# Altium schematic sheet OZ440-SE100-CAR003_sheet4.SchDoc
size A3
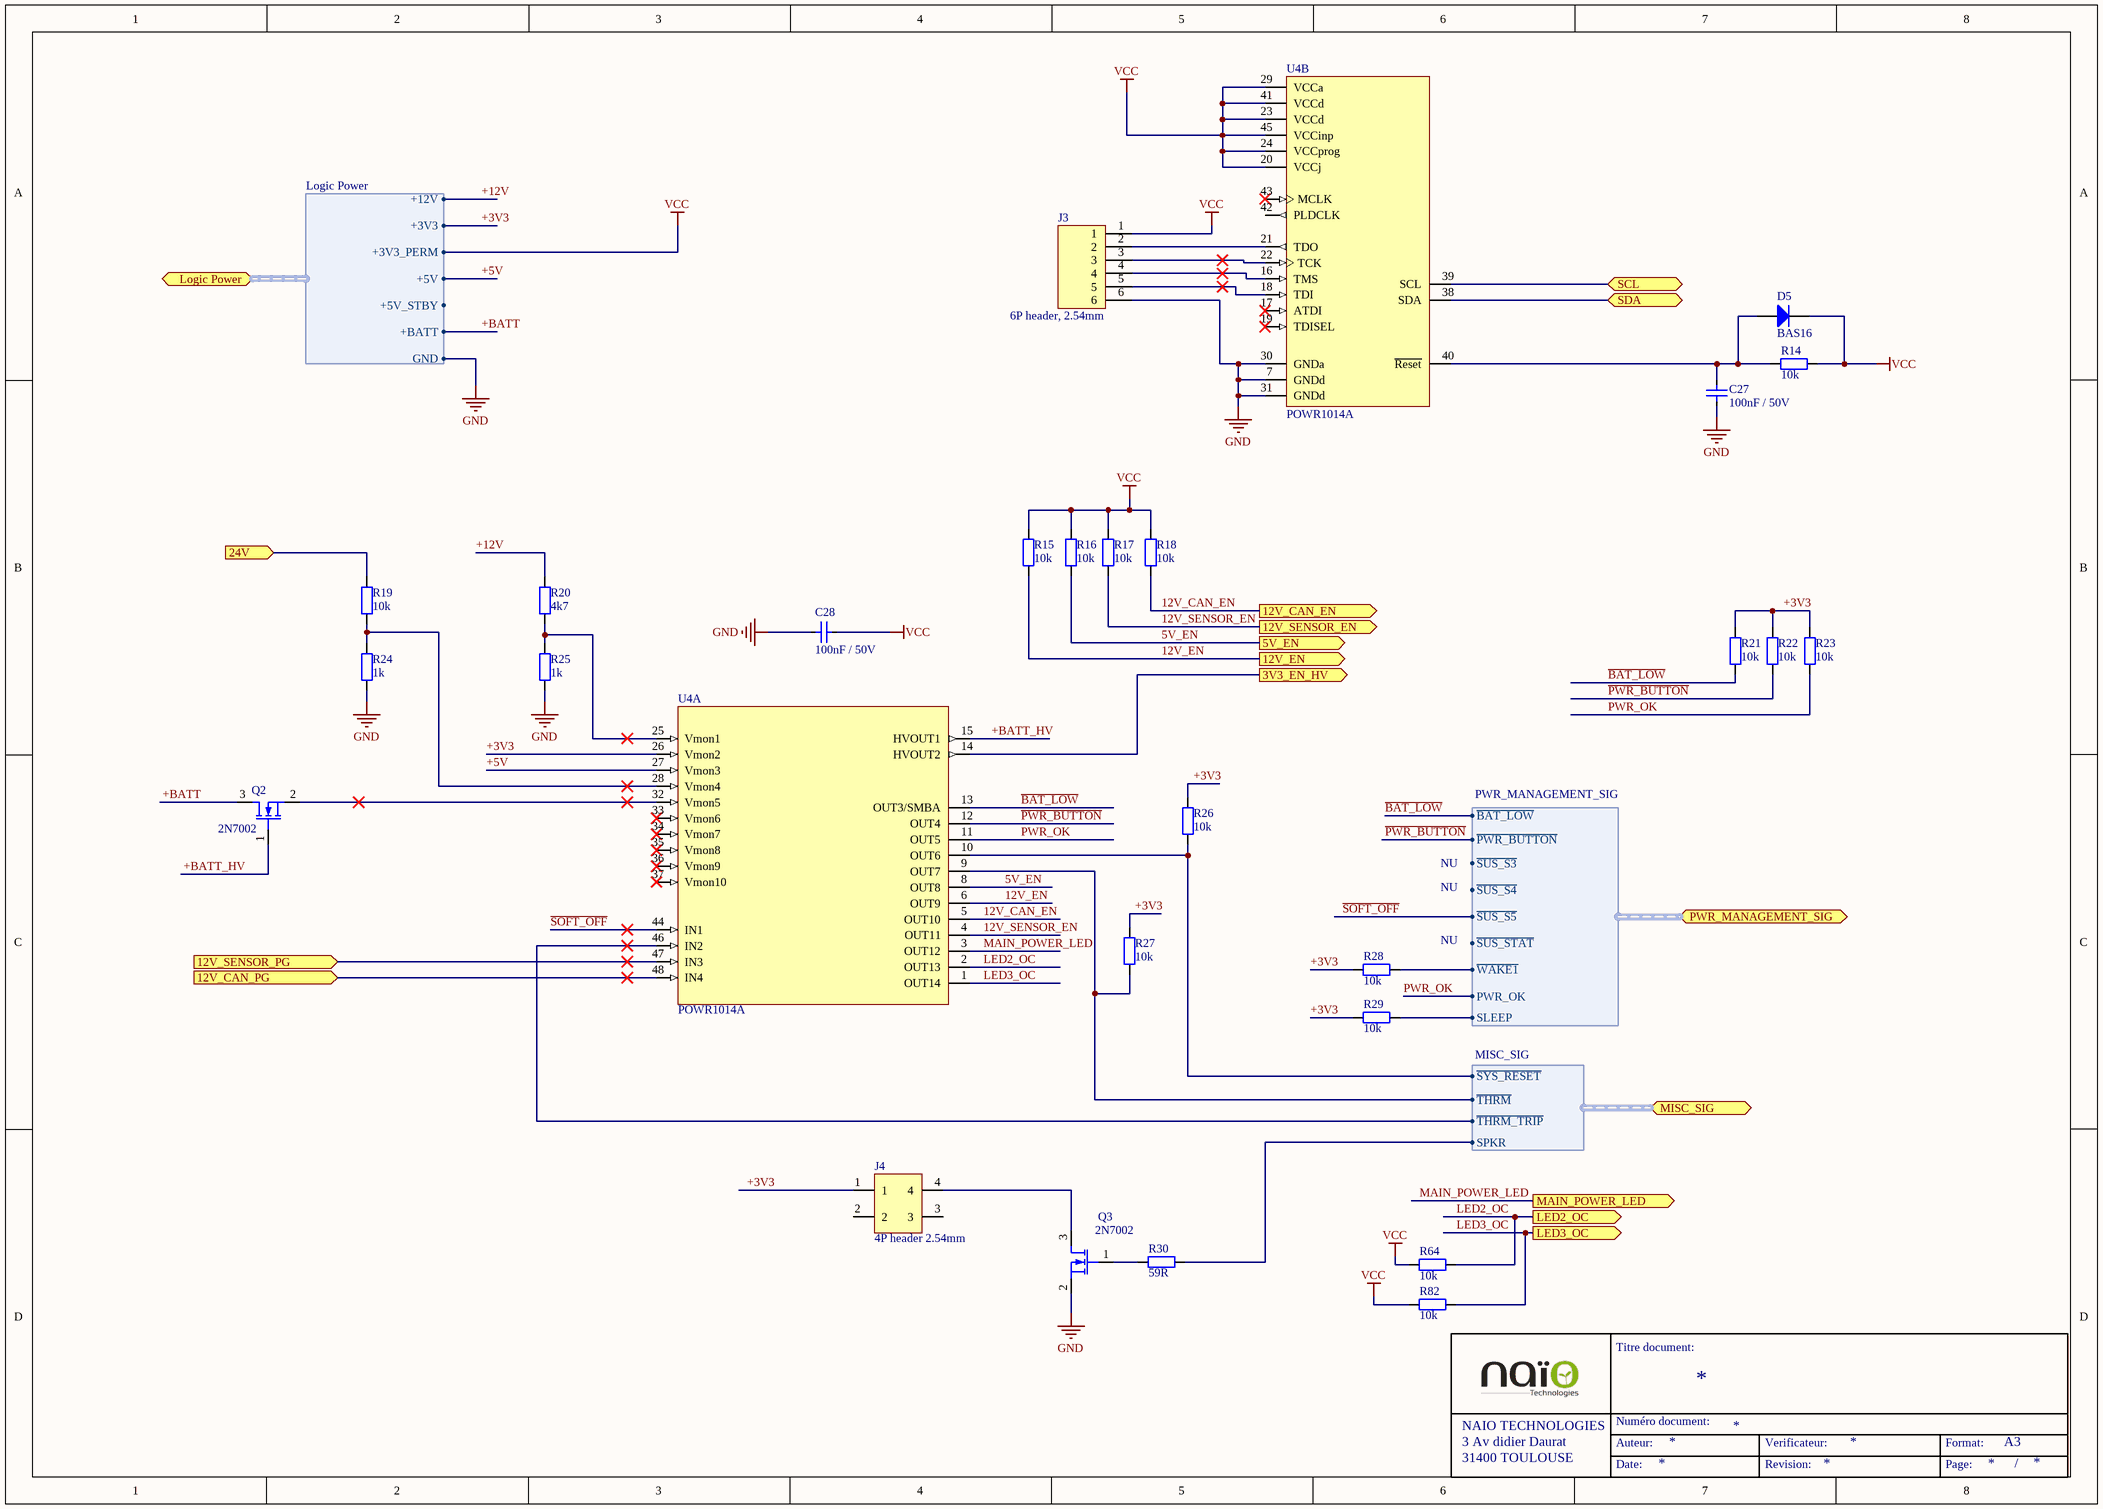
[diagram p0: OZ440-SE100-CAR003_sheet4.SchDoc]

## Parts
C27  Displayed reference: 100nF / 50V  [C0805-STD]  (hidden comment: CAP-SMD)
C28  Displayed reference: 100nF / 50V  [C0805-STD]  (hidden comment: CAP-SMD)
D5  Displayed reference: BAS16  [SOT23-STD]  (hidden comment: BAS16-SOT23)
J3  Displayed reference: 6P header, 2.54mm  [6P_HEADER-STD_TH_1ROW]  (hidden comment: CONN-STD-6P_1ROW)
J4  Displayed reference: 4P header 2.54mm  [4P_HEADER-SPE-1241050-2]  (hidden comment: CONN-STD-4P_2ROW)
Q2  Displayed reference: 2N7002  [SOT23-SPE-2N7002]  (hidden comment: 2N7002-SMD3P)
Q3  Displayed reference: 2N7002  [SOT23-SPE-2N7002]  (hidden comment: 2N7002-SMD3P)
R14  Displayed reference: 10k  [R0805-STD]  (hidden comment: RES-SMD)
R15  Displayed reference: 10k  [R0805-STD]  (hidden comment: RES-SMD)
R16  Displayed reference: 10k  [R0805-STD]  (hidden comment: RES-SMD)
R17  Displayed reference: 10k  [R0805-STD]  (hidden comment: RES-SMD)
R18  Displayed reference: 10k  [R0805-STD]  (hidden comment: RES-SMD)
R19  Displayed reference: 10k  [R0805-STD]  (hidden comment: RES-SMD)
R20  Displayed reference: 4k7  [R0805-STD]  (hidden comment: RES-SMD)
R21  Displayed reference: 10k  [R0805-STD]  (hidden comment: RES-SMD)
R22  Displayed reference: 10k  [R0805-STD]  (hidden comment: RES-SMD)
R23  Displayed reference: 10k  [R0805-STD]  (hidden comment: RES-SMD)
R24  Displayed reference: 1k  [R0805-STD]  (hidden comment: RES-SMD)
R25  Displayed reference: 1k  [R0805-STD]  (hidden comment: RES-SMD)
R26  Displayed reference: 10k  [R0805-STD]  (hidden comment: RES-SMD)
R27  Displayed reference: 10k  [R0805-STD]  (hidden comment: RES-SMD)
R28  Displayed reference: 10k  [R0805-STD]  (hidden comment: RES-SMD)
R29  Displayed reference: 10k  [R0805-STD]  (hidden comment: RES-SMD)
R30  Displayed reference: 59R  [R0805-STD]  (hidden comment: RES-SMD)
R64  Displayed reference: 10k  [R0805-STD]  (hidden comment: RES-SMD)
R82  Displayed reference: 10k  [R0805-STD]  (hidden comment: RES-SMD)
U4  Displayed reference: POWR1014A  [TQFP48-SPE-PWR1014]  (hidden comment: PWR1014A-TQFP48)  (parts A,B of 2)

## Ports
3V3_EN_HV (out), 5V_EN (out), 12V_CAN_EN (out), 12V_CAN_PG (in), 12V_EN (out), 12V_SENSOR_EN (out), 12V_SENSOR_PG (in), 24V (in), LED2_OC (out), LED3_OC (out), Logic Power (harness Logic Power), MAIN_POWER_LED (out), MISC_SIG (harness MISC_SIG), PWR_MANAGEMENT_SIG (harness PWR_MANAGEMENT_SIG), SCL, SDA

## Harnesses
Logic Power: +12V, +3V3, +3V3_PERM, +5V, +5V_STBY, +BATT, GND
PWR_MANAGEMENT_SIG: ~{BAT_LOW}, ~{PWR_BUTTON}, ~{SUS_S3}, ~{SUS_S4}, ~{SUS_S5}, ~{SUS_STAT}, ~{WAKE1}, PWR_OK, SLEEP
MISC_SIG: ~{SYS_RESET}, ~{THRM}, ~{THRM_TRIP}, SPKR

## Nets
GND: C27.1 C28.1 J3.6 Q3.2(S) R24.1 R25.1 U4.7(GNDd) U4.30(GNDa) U4.31(GNDd) ; port Logic Power.GND
VCC: C28.2 D5.3(K) J3.1 R14.1 R15.1 R16.1 R17.1 R18.1 R64.2 R82.2 U4.20(VCCj) U4.23(VCCd) U4.24(VCCprog) U4.29(VCCa) U4.41(VCCd) U4.45(VCCinp) ; port Logic Power.+3V3_PERM
3V3_EN_HV: U4.14(HVOUT2) ; port 3V3_EN_HV
5V_EN: R16.2 U4.8(OUT8) ; port 5V_EN
12V_CAN_EN: R18.2 U4.5(OUT10) ; port 12V_CAN_EN
12V_CAN_PG: U4.48(IN4) ; port 12V_CAN_PG
12V_EN: R15.2 U4.6(OUT9) ; port 12V_EN
12V_SENSOR_EN: R17.2 U4.4(OUT11) ; port 12V_SENSOR_EN
12V_SENSOR_PG: U4.47(IN3) ; port 12V_SENSOR_PG
24V: R19.2 ; port 24V
+3V3: J4.1 R21.1 R22.1 R23.1 R26.1 R27.1 R28.2 R29.2 U4.26(Vmon2) ; port Logic Power.+3V3
+5V: U4.27(Vmon3) ; port Logic Power.+5V
+12V: R20.2 ; port Logic Power.+12V
+BATT: Q2.3(D) ; port Logic Power.+BATT
+BATT_HV: Q2.1(G) U4.15(HVOUT1)
~{BAT_LOW}: R21.2 U4.13(OUT3/SMBA) ; port PWR_MANAGEMENT_SIG.~{BAT_LOW}
~{PWR_BUTTON}: R22.2 U4.12(OUT4) ; port PWR_MANAGEMENT_SIG.~{PWR_BUTTON}
~{SOFT_OFF}: U4.44(IN1) ; port PWR_MANAGEMENT_SIG.~{SUS_S5}
LED2_OC: R64.1 U4.2(OUT13) ; port LED2_OC
LED3_OC: R82.1 U4.1(OUT14) ; port LED3_OC
MAIN_POWER_LED: U4.3(OUT12) ; port MAIN_POWER_LED
PWR_OK: R23.2 U4.11(OUT5) ; port PWR_MANAGEMENT_SIG.PWR_OK
SCL: U4.39(SCL) ; port SCL
SDA: U4.38(SDA) ; port SDA
NetC27_2: C27.2 D5.1(A) R14.2 U4.40(~{Reset})
NetJ3_2: J3.2 U4.21(TDO)
NetJ3_3: J3.3 U4.22(TCK)
NetJ3_4: J3.4 U4.16(TMS)
NetJ3_5: J3.5 U4.18(TDI)
NetJ4_4: J4.4 Q3.3(D)
NetQ2_2: Q2.2(S) U4.32(Vmon5)
NetQ3_1: Q3.1(G) R30.1
NetR19_1: R19.1 R24.2 U4.28(Vmon4)
NetR20_1: R20.1 R25.2 U4.25(Vmon1)
NetR26_2: R26.2 U4.10(OUT6) ; port MISC_SIG.~{SYS_RESET}
NetR27_2: R27.2 U4.9(OUT7) ; port MISC_SIG.~{THRM}
NetR28_1: R28.1 ; port PWR_MANAGEMENT_SIG.~{WAKE1}
NetR29_1: R29.1 ; port PWR_MANAGEMENT_SIG.SLEEP
NetR30_2: R30.2 ; port MISC_SIG.SPKR
NetU4_46: U4.46(IN2) ; port MISC_SIG.~{THRM_TRIP}

Not connected (* = marked no-connect by the designer): J4 2 3; U4 17(ATDI)* 19(TDISEL)* 33(Vmon6)* 34(Vmon7)* 35(Vmon8)* 36(Vmon9)* 37(Vmon10)* 42(PLDCLK) 43(MCLK)*

## Notes on the sheet
- NU
- Titre document:
- NAIO TECHNOLOGIES
- 3 Av didier Daurat
- 31400 TOULOUSE
- Auteur:
- Numéro document:
- Verificateur:
- Format:
- A3
- Date:
- Revision:
- Page:
- /

## Library data of the parts
C27 C28 = VJ0805Y104KXAxx: 0805 100nF / 50V  X7R ceramic capacitor; Manufacturer: vishay; Max Voltage: 50; Tolerance: +/- 10%; Validated: N; Reference: VJ0805Y104KXAxx; Value: 100nF; Material: X7R; Footprint description: standard Capacitor 0805; Pin Count: 2; helpURL: http://www.vishay.com/docs/45200/highrels.pdf; Supplier 1: Farnell; Supplier Part Number 1: 1612208; Supplier 2: Digi-Key; Supplier Part Number 2: 720-1266-6-ND
D5 = BAS16: 100V / 120mA signal  diode; Manufacturer: NXP; Max Voltage: 100; Max Current: 0.2A; Validated: False; Reference: BAS16; component type: DIODE; Footprint description: Sot23 SMD package; Pin Count: 3; Rev: 2010; helpURL: http://www.nxp.com/documents/data_sheet/BAS16_SER.pdf; Supplier 1: Farnell; Supplier Part Number 1: 1081180; Supplier 2: Digi-Key; Supplier Part Number 2: 568-1596-1-ND
J3 = 68000-406HLF: 6P, 1 row, 2.54mm header; Manufacturer: FCI; Validated: False; Reference: 68000-406HLF; Footprint description: TH, 6 pin, 2.54mm; Pin Count: 6; Rev: DB; helpURL: http://portal.fciconnect.com/Comergent//fci/drawing/68000.pdf
J4 = 1241050-2: 4P, 2 rows, 2.54mm header; Manufacturer: TE CONNECTIVITY; Validated: False; Reference: 1241050-2; Footprint description: SMT 4 pins, 2 rows, 2.54mm pitch; Pin Count: 4; Rev: A9; helpURL: http://www.te.com/catalog/pn/en/1241050-2?RQPN=1241050-2; Supplier 1: Farnell; Supplier Part Number 1: 9689630
Q2 Q3 = 2N7002: N-Channel Enhancement Mode Field Effect Transistor; Manufacturer: FAIRCHILD; Max Voltage: 60 V; Max Current: 0,4 A; Rated Power: 0,2 W; Validated: False; Reference: 2N7002; component type: NMOS; Footprint description: SOT23; Pin Count: 3; Rev: A1; helpURL: http://www.fairchildsemi.com/ds/2N/2N7000.pdf; Supplier 1: Farnell; Supplier Part Number 1: 9845313; Supplier 2: Newark; Supplier Part Number 2: 58K9651
R14-R19 R21-R23 R26-R29 R64 R82 = CRCW080510K0FKxx: 10k Ohm 0805 SMD resistor; Manufacturer: Vishay; Value: 10 000; Tolerance: 1 %; Rated Power: 0,125 W; Validated: No; Reference: CRCW080510K0FKxx; Footprint description: standard 0805 SMD; Pin Count: 2; helpURL: http://www.vishay.com/docs/20035/dcrcwe3.pdf; Supplier 1: Farnell; Supplier Part Number 1: 1469856; Supplier 2: Mouser; Supplier Part Number 2: 71-CRCW0805-10K-E3
R20 = CRCW08054K70FKxx: 4,7k Ohm 0805 SMD resistor; Manufacturer: Vishay; Value: 4 700; Tolerance: 1 %; Rated Power: 0,125 W; Validated: No; Reference: CRCW08054K70FKxx; Footprint description: standard 0805 SMD; Pin Count: 2; helpURL: http://www.vishay.com/docs/20035/dcrcwe3.pdf; Supplier 1: Farnell; Supplier Part Number 1: 1469923; Supplier 2: Mouser; Supplier Part Number 2: 71-CRCW0805-4.7K-E3
R24 R25 = CRCW08051K00FKxx: 1k Ohm 0805 SMD resistor; Manufacturer: Vishay; Value: 1 000; Tolerance: 1 %; Rated Power: 0,125 W; Validated: No; Reference: CRCW08051K00FKxx; Footprint description: standard 0805 SMD; Pin Count: 2; helpURL: http://www.vishay.com/docs/20035/dcrcwe3.pdf; Supplier 1: Farnell; Supplier Part Number 1: 1469847; Supplier 2: Mouser; Supplier Part Number 2: 71-CRCW0805-1.0K-E3
R30 = CRCW080559R0FKxx: 59 Ohm 0805 SMD resistor; Manufacturer: Vishay; Value: 59; Tolerance: 1 %; Rated Power: 0.125 W; Validated: No; Reference: CRCW080559R0FKxx; Footprint description: standard 0805 SMD; Pin Count: 2; helpURL: http://www.vishay.com/docs/20035/dcrcwe3.pdf; Supplier 1: Mouser; Supplier Part Number 1: 71-CRCW080559R0FKEA; Supplier 2: Farnell; Supplier Part Number 2: 2138817
U4 = ispPAC-POWR1014A-01TN48I: ispPAC power manager; Manufacturer: LATTICE; Validated: False; Reference: ispPAC-POWR1014A-01TN48I; Footprint description: TQFP48; Pin Count: 48; Rev: 1.9; helpURL: http://www.latticesemi.com/documents/DS1014.pdf; Supplier 1: Farnell; Supplier Part Number 1: 1735242; Supplier 2: Digi-Key; Supplier Part Number 2: 220-1171-ND